# Altium schematic sheet PinAssign.SchDoc
size A4
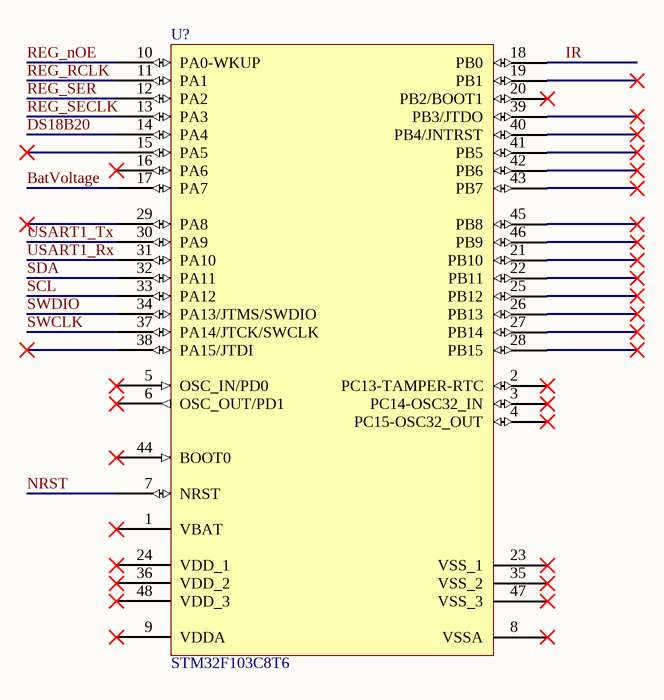
[diagram p0: PinAssign.SchDoc]

## Parts
U?  STM32F103C8T6  [LQFP48_N]

## Nets
BatVoltage: U?.17(PA7)
DS18B20: U?.14(PA4)
IR: U?.18(PB0)
NRST: U?.7(NRST)
REG_nOE: U?.10(PA0-WKUP)
REG_RCLK: U?.11(PA1)
REG_SECLK: U?.13(PA3)
REG_SER: U?.12(PA2)
SCL: U?.33(PA12)
SDA: U?.32(PA11)
SWCLK: U?.37(PA14/JTCK/SWCLK)
SWDIO: U?.34(PA13/JTMS/SWDIO)
USART1_Rx: U?.31(PA10)
USART1_Tx: U?.30(PA9)

Not connected (* = marked no-connect by the designer): U? 1(VBAT)* 2(PC13-TAMPER-RTC)* 3(PC14-OSC32_IN)* 4(PC15-OSC32_OUT)* 5(OSC_IN/PD0)* 6(OSC_OUT/PD1)* 8(VSSA)* 9(VDDA)* 15(PA5)* 16(PA6)* 19(PB1)* 20(PB2/BOOT1)* 21(PB10)* 22(PB11)* 23(VSS_1)* 24(VDD_1)* 25(PB12)* 26(PB13)* 27(PB14)* 28(PB15)* 29(PA8)* 35(VSS_2)* 36(VDD_2)* 38(PA15/JTDI)* 39(PB3/JTDO)* 40(PB4/JNTRST)* 41(PB5)* 42(PB6)* 43(PB7)* 44(BOOT0)* 45(PB8)* 46(PB9)* 47(VSS_3)* 48(VDD_3)*

## Library data of the parts
U? = STM32F103C8T6: STM32 ARM-based 32-bit MCU with 64 Kbytes Flash, 48-pin LQFP, Industrial Temperature; Published: 30-May-2008; DatasheetVersion: rev6, Mar-2008; PackageVersion: Mar-2008; PackageReference: LQFP48; Publisher: Altium Limited; PackageDescription: 48-Pin Low-Profile Quad Flat Pack, 7 x 7 mm Body, 0.5 mm Pitch (LQFP48); ComponentLink1Description: Manufacturer Link; ComponentLink1URL: www.st.com/stm32; ComponentLink2Description: Datasheet; ComponentLink2URL: http://www.st.com/stonline/products/literature/ds/13587.pdf